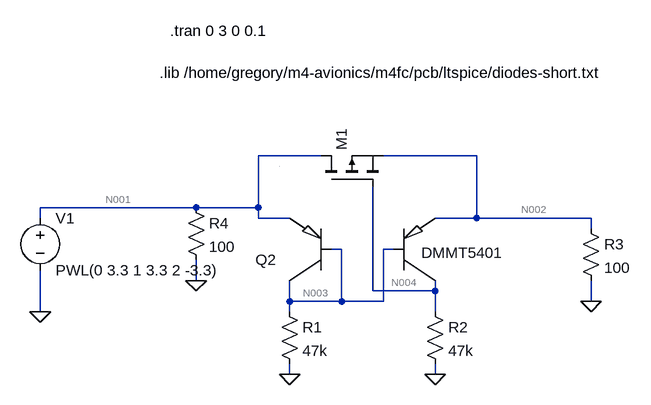
[diagram p0: schematic ideal_diode.asc]
ideal_diode.asc, the LTspice schematic file:
Version 4
SHEET 1 980 680
WIRE 64 -16 -32 -16
WIRE 304 -16 160 -16
WIRE -128 64 -368 64
WIRE -32 64 -32 -16
WIRE -32 64 -128 64
WIRE -368 80 -368 64
WIRE -32 80 -32 64
WIRE 16 80 -32 80
WIRE 304 80 304 -16
WIRE 304 80 240 80
WIRE 480 80 304 80
WIRE 480 96 480 80
WIRE 96 128 80 128
WIRE 176 128 160 128
WIRE -128 176 -128 144
WIRE 144 192 144 32
WIRE 240 192 240 176
WIRE 240 192 144 192
WIRE 16 208 16 176
WIRE 96 208 96 128
WIRE 96 208 16 208
WIRE 160 208 160 128
WIRE 160 208 96 208
WIRE 480 208 480 176
WIRE -368 224 -368 160
WIRE 16 224 16 208
WIRE 240 224 240 192
WIRE 16 320 16 304
WIRE 240 320 240 304
WIRE 0 0 0 0
FLAG -368 224 0
FLAG 16 320 0
FLAG 240 320 0
FLAG 480 208 0
FLAG -128 176 0
SYMBOL voltage -368 64 R0
WINDOW 123 0 0 Left 2
WINDOW 39 0 0 Left 2
SYMATTR InstName V1
SYMATTR Value PWL(0 3.3 1 3.3 2 -3.3)
SYMBOL pmos 64 32 R270
SYMATTR InstName M1
SYMATTR Value ""
SYMATTR Prefix X
SYMATTR SpiceModel DMG2305UX
SYMBOL dmmt5401 0 80 R0
WINDOW 38 219 53 Left 2
SYMATTR InstName Q2
SYMATTR Value ""
SYMATTR Prefix X
SYMBOL res 0 208 R0
SYMATTR InstName R1
SYMATTR Value 47k
SYMBOL res 224 208 R0
SYMATTR InstName R2
SYMATTR Value 47k
SYMBOL res 464 80 R0
SYMATTR InstName R3
SYMATTR Value 100
SYMBOL res -144 48 R0
SYMATTR InstName R4
SYMATTR Value 100
TEXT -168 -208 Left 2 !.tran 0 3 0 0.1
TEXT -184 -144 Left 2 !.lib /home/gregory/m4-avionics/m4fc/pcb/ltspice/diodes-short.txt

The netlist it stands for:
* ideal_diode.asc
V1 N001 0 PWL(0 3.3 1 3.3 2 -3.3)
XM1 N001 N004 N002 DMG2305UX  ; pins D G S
XQ2 N003 N003 N003 N004 N002 N001 DMMT5401  ; pins C B B1 C1 E1 E
R1 N003 0 47k
R2 N004 0 47k
R3 N002 0 100
R4 N001 0 100
.tran 0 3 0 0.1
.lib /home/gregory/m4-avionics/m4fc/pcb/ltspice/diodes-short.txt
.backanno
.end

* Results of the author's LTspice run, read from the files saved beside the schematic
* Operating Point, zero values left out:
*   V(n001) = 3.3 V
*   V(n002) = 3.294 V
*   V(n004) = 2.202 V
*   V(n003) = 2.765 V
*   I(R4) = 33 mA
*   I(R3) = 32.94 mA
*   I(R2) = 46.86 µA
*   I(R1) = 58.82 µA
*   I(V1) = -66.05 mA
*   Ix(m1:10) = 32.99 mA
*   Ix(m1:20) = -86.47 pA
*   Ix(m1:30) = -32.99 mA
*   Ix(q2:1) = -57.89 µA
*   Ix(q2:2) = -511 nA
*   Ix(q2:3) = -416.4 nA
*   Ix(q2:4) = -46.86 µA
*   Ix(q2:5) = 47.27 µA
*   Ix(q2:6) = 58.4 µA
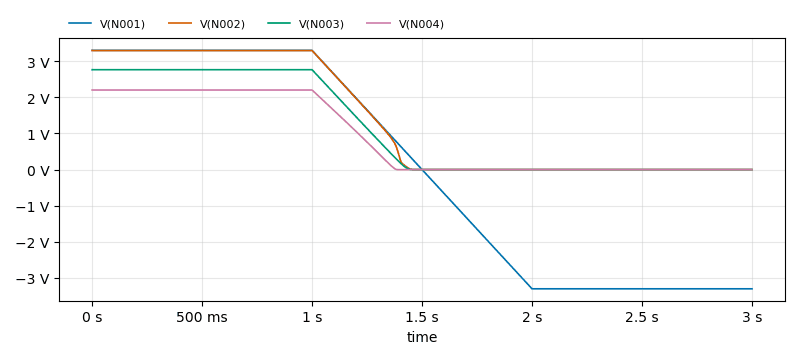
[diagram p1: Transient Analysis of ideal_diode.asc, plotted from the saved traces]
* Transient Analysis, 1 run:
*   V(N001): min -3.3 V, max 3.3 V, average 0 V, rms 2.918 V, last -3.3 V
*   V(N002): min -339.9 nV, max 3.294 V, average 1.36 V, rms 2.054 V, last 0 V
*   V(N003): min -20.29 µV, max 2.765 V, average 1.118 V, rms 1.707 V, last 0 V
*   V(N004): min -1.143 mV, max 2.202 V, average 874.1 mV, rms 1.352 V, last 0 V